# EAGLE schematic stm32_encoderXY_imu (EAGLE 9.5.2)
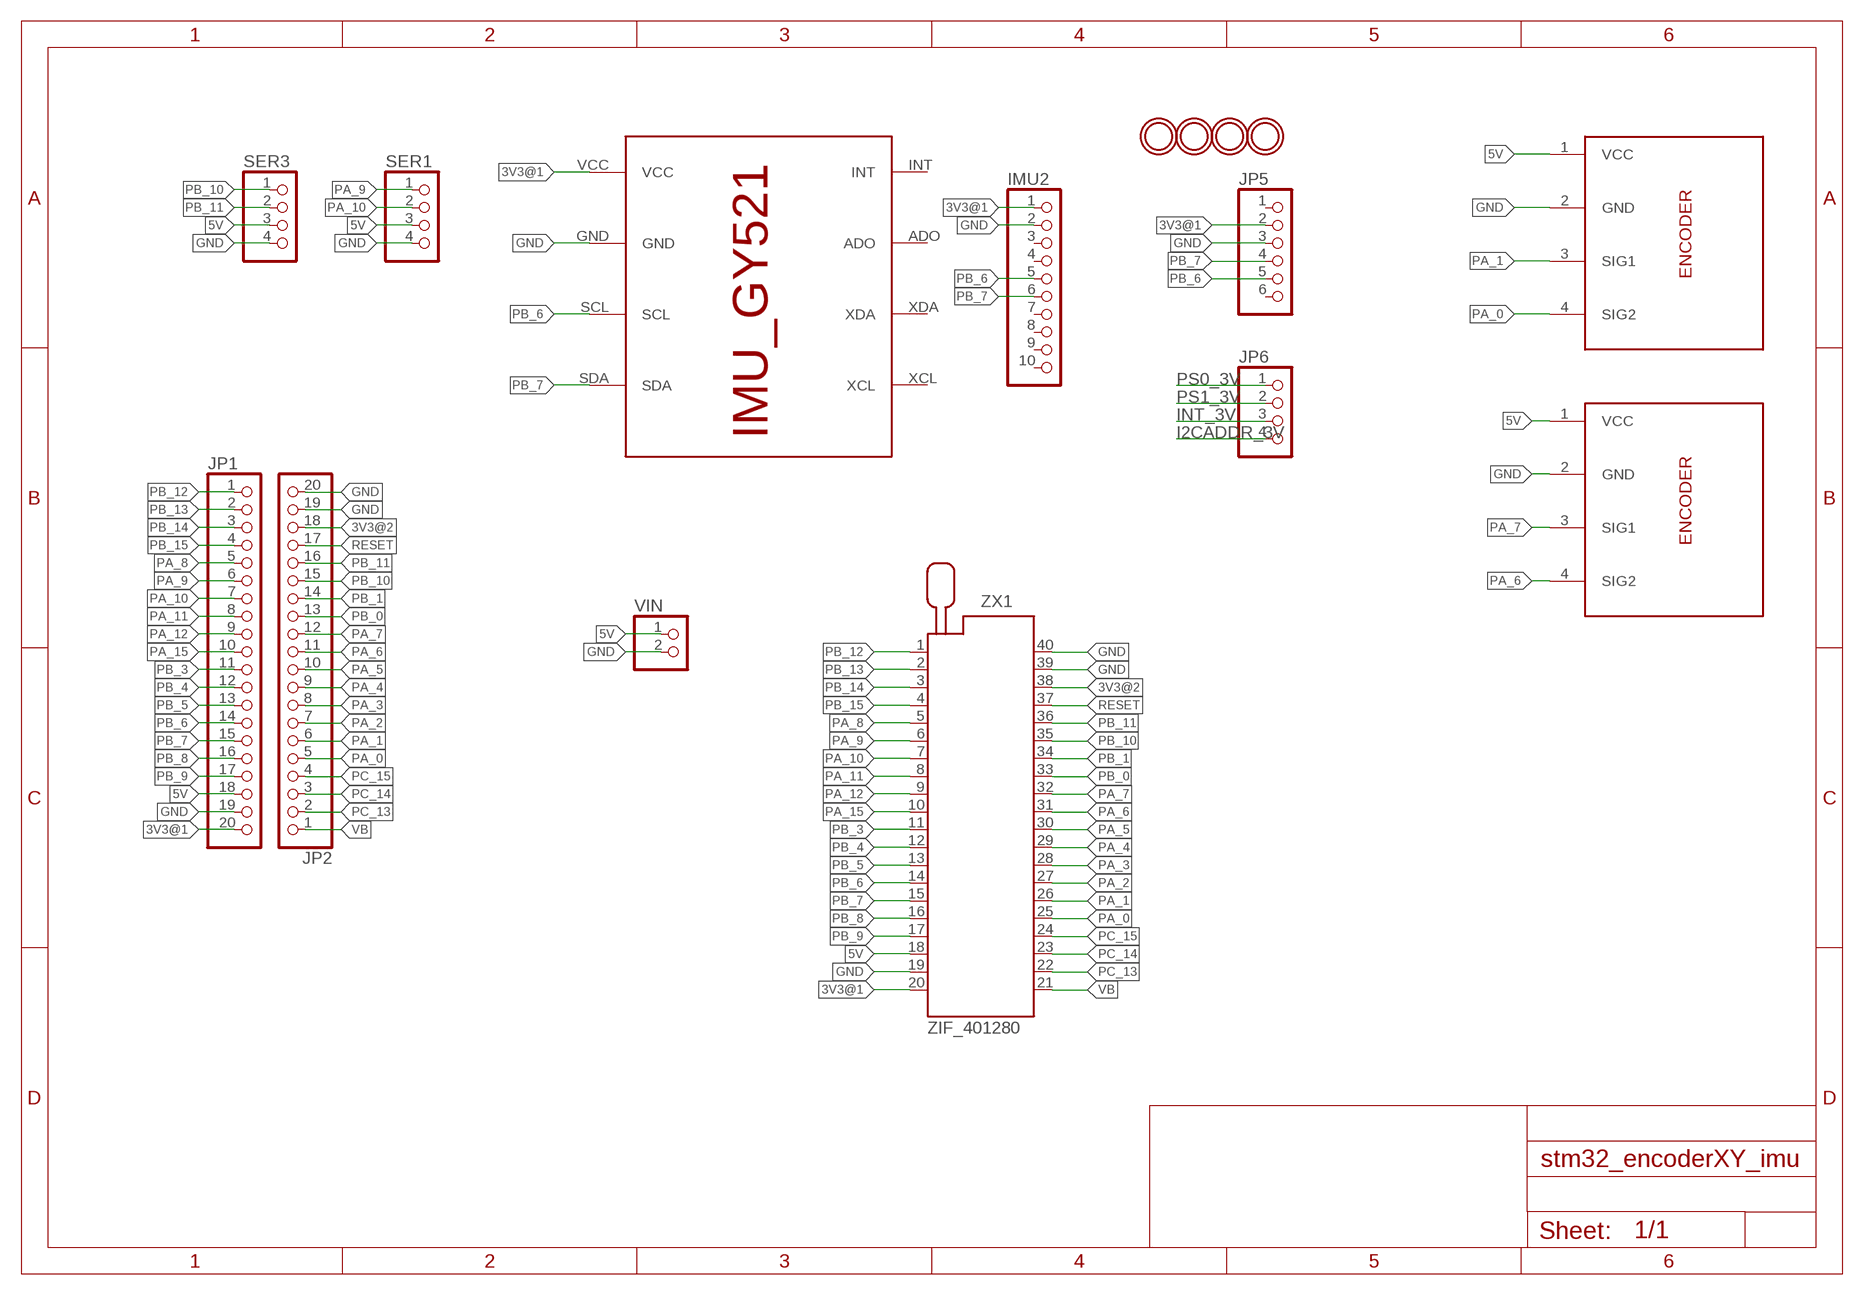
[diagram p0: schematic, sheet 1]

## Parts
ENC1  ENC_Y  ENCODER  [1X04_DATA]
ENC2  ENC_X  ENCODER  [1X04_DATA]
IMU1  IMU_ROBOCON_GY521  [IMU_GY521]
IMU2  PINHD-1X10  [1X10]
JP1  PINHD-1X20  [1X20]
JP2  PINHD-1X20  [1X20]
JP5  HEADER-1X676MIL  [1X06_ROUND_76]
JP6  HEADER-1X476MIL  [1X04_ROUND_76]
SER1  PINHD-4_DATA  [1X04_DATA]
SER3  PINHD-4_DATA  [1X04_DATA]
U$4  MOUNTINGHOLE2.5_THICK  [MOUNTINGHOLE_2.5_PLATED_THICK]
U$5  MOUNTINGHOLE2.5_THICK  [MOUNTINGHOLE_2.5_PLATED_THICK]
U$6  MOUNTINGHOLE2.5_THICK  [MOUNTINGHOLE_2.5_PLATED_THICK]
U$7  MOUNTINGHOLE2.5_THICK  [MOUNTINGHOLE_2.5_PLATED_THICK]
VIN  PINHD-2_DATA  [1X02_DATA]
ZX1  ZIF_401280  [240-1280-00-0602J]

## Nets
3V3@1: IMU1.VCC IMU2.1 JP1.20 JP5.2 ZX1.20
3V3@2: JP2.18 ZX1.38
5V: ENC1.1(VCC) ENC2.1(VCC) JP1.18 SER1.3 SER3.3 VIN.1 ZX1.18
GND: ENC1.2(GND) ENC2.2(GND) IMU1.GND IMU2.2 JP1.19 JP2.19 JP2.20 JP5.3 SER1.4 SER3.4 VIN.2 ZX1.19 ZX1.39 ZX1.40
I2CADDR_3V: JP6.4
INT_3V: JP6.3
PA_0: ENC2.4(SIG2) JP2.5 ZX1.25
PA_1: ENC2.3(SIG1) JP2.6 ZX1.26
PA_2: JP2.7 ZX1.27
PA_3: JP2.8 ZX1.28
PA_4: JP2.9 ZX1.29
PA_5: JP2.10 ZX1.30
PA_6: ENC1.4(SIG2) JP2.11 ZX1.31
PA_7: ENC1.3(SIG1) JP2.12 ZX1.32
PA_8: JP1.5 ZX1.5
PA_9: JP1.6 SER1.1 ZX1.6
PA_10: JP1.7 SER1.2 ZX1.7
PA_11: JP1.8 ZX1.8
PA_12: JP1.9 ZX1.9
PA_15: JP1.10 ZX1.10
PB_0: JP2.13 ZX1.33
PB_1: JP2.14 ZX1.34
PB_3: JP1.11 ZX1.11
PB_4: JP1.12 ZX1.12
PB_5: JP1.13 ZX1.13
PB_6: IMU1.SCL IMU2.5 JP1.14 JP5.5 ZX1.14
PB_7: IMU1.SDA IMU2.6 JP1.15 JP5.4 ZX1.15
PB_8: JP1.16 ZX1.16
PB_9: JP1.17 ZX1.17
PB_10: JP2.15 SER3.1 ZX1.35
PB_11: JP2.16 SER3.2 ZX1.36
PB_12: JP1.1 ZX1.1
PB_13: JP1.2 ZX1.2
PB_14: JP1.3 ZX1.3
PB_15: JP1.4 ZX1.4
PC_13: JP2.2 ZX1.22
PC_14: JP2.3 ZX1.23
PC_15: JP2.4 ZX1.24
PS0_3V: JP6.1
PS1_3V: JP6.2
RESET: JP2.17 ZX1.37
VB: JP2.1 ZX1.21
Unconnected: IMU1.ADO IMU1.INT IMU1.XCL IMU1.XDA IMU2.3 IMU2.4 IMU2.7 IMU2.8 IMU2.9 IMU2.10 JP5.1 JP5.6

## Library data of the parts
ENC1 ENC2 = MIA_LIBRARY-2-2-2:ENCODER
IMU1 = MIA_LIBRARY-2-2-2:IMU_ROBOCON_GY521
IMU2 = MIA-Training:PINHD-1X10: PIN HEADER
JP1 JP2 = MIA_LIBRARY-2-2-2:PINHD-1X20: PIN HEADER
JP5 = microbuilder:HEADER-1X6: PIN HEADER
JP6 = microbuilder:HEADER-1X4: PIN HEADER
SER1 SER3 = MIA_LIBRARY-2-2-2:PINHD-4_DATA: PIN HEADER
U$4-U$7 = microbuilder:MOUNTINGHOLE: Mounting Hole For #2 screws (0.086"/2.18mm width, 0.094"/2.4mm hole) use 2.5mm; BOM: EXCLUDE
VIN = MIA_LIBRARY-2-2-2:PINHD-2_DATA: PIN HEADER
ZX1 = MIA_LIBRARY-2-2-2:ZIF_40: Zero Insertion Force Socked Source: http://www.3M.com/ehpd